# EAGLE design step_down_module (EAGLE 9.6.2)
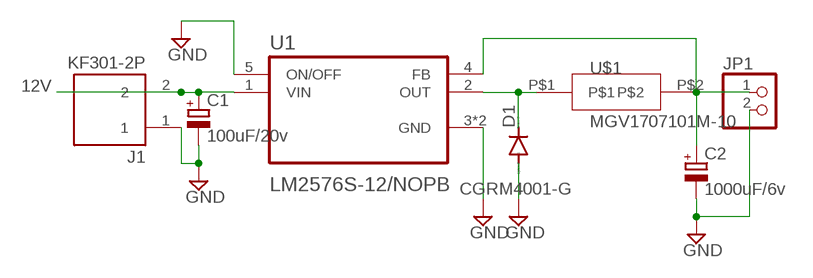
[diagram p0: schematic, sheet 1]

## Parts
C1  100uF/20v  CPOL-EUD/7343-31W  [D/7343-31W]
C2  1000uF/6v  CPOL-EUD/7343-31W  [D/7343-31W]
D1  CGRM4001-G  [SOD-123_MINI-SMA]
J1  KF301-2P  [HANDSON_KF301-2P]
JP1  PINHD-1X2  [1X02]
U1  LM2576S-12/NOPB  [VREG_TPS79625KTTR]
U$1  MGV1707101M-10  [MGV1707101M-10]

## Nets
12V: C1.+ J1.2 U1.1(VIN)
GND: C1.- C2.- D1.A J1.1 JP1.2 U1.3(GND) U1.5(ON/OFF) U1.6(GND)
N$2: D1.C U1.2(OUT) U$1.P$1
N$3: C2.+ JP1.1 U1.4(FB) U$1.P$2

## Library data of the parts
C1 C2 = rcl:CPOL-EU: POLARIZED CAPACITOR, European symbol; SPICEPREFIX: C
D1 = diode:CGRM400*-G: Molded plasitc,JEDEC SOD-123/Mini SMA Source: Comchip CGRM4001-G.pdf
J1 = KF301-2P:KF301-2P: 2 Pin Terminal Block 5mm Pitch Check availability <https://pricing.snapeda.com/parts/KF301-2P/Handson%20Technology/view-part?ref=eda>; AVAILABILITY: Not in stock; DESCRIPTION: 2 Pin Terminal Block 5mm Pitch; MF: Handson Technology; MP: KF301-2P; PACKAGE: None; PRICE: None
JP1 = pinhead:PINHD-1X2: PIN HEADER
U1 = LM2576S-12_NOPB:LM2576S-12/NOPB: Check availability <https://pricing.snapeda.com/parts/LM2576S-12/NOPB/Texas%20Instruments/view-part?ref=eda>; AVAILABILITY: In Stock; CHECK_PRICES: https://www.snapeda.com/parts/LM2576S-12/NOPB/Texas+Instruments/view-part/?ref=eda; DESCRIPTION: SIMPLE SWITCHER&reg; 40V, 3A Low Component Count Step-Down Regulator; MF: Texas Instruments; MP: LM2576S-12/NOPB; PACKAGE: TO-263-5 Texas Instruments; PRICE: None; PURCHASE-URL: https://www.snapeda.com/api/url_track_click_mouser/?unipart_id=470772&manufacturer=Texas Instruments&part_name=LM2576S-12/NOPB&search_term=None; SNAPEDA_LINK: https://www.snapeda.com/parts/LM2576S-12/NOPB/Texas+Instruments/view-part/?ref=snap
U$1 = MGV1707101M-10:MGV1707101M-10

## Board
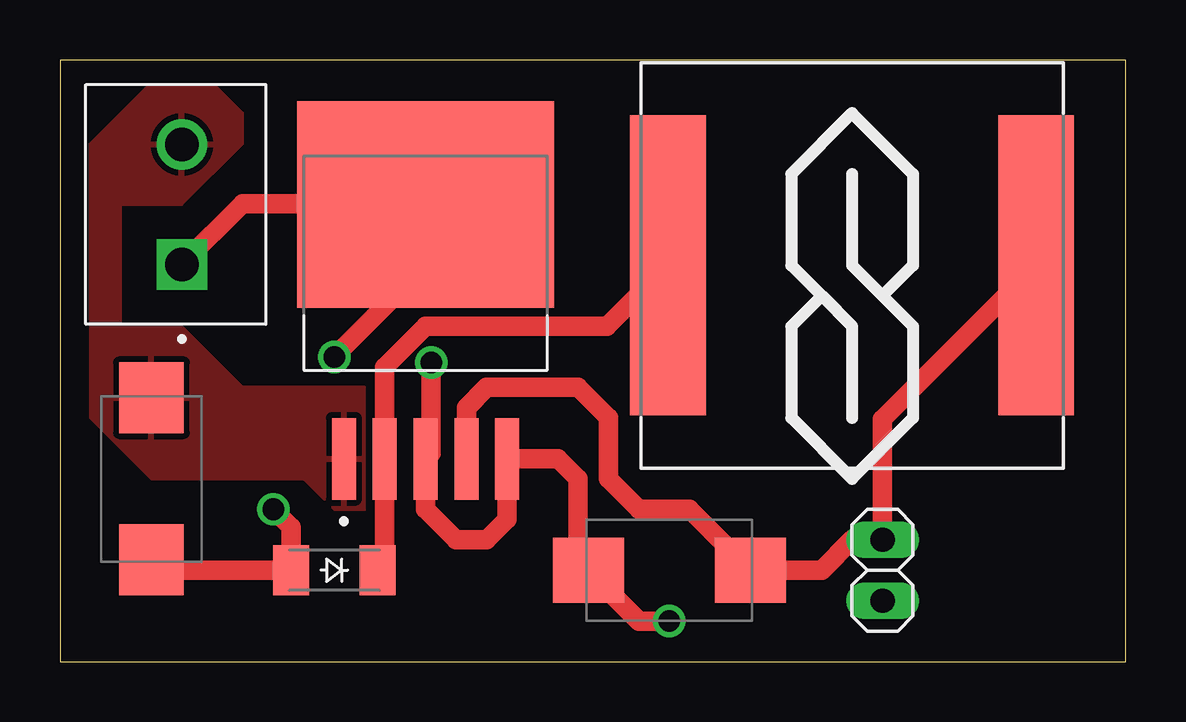
[diagram p1: board, top side]
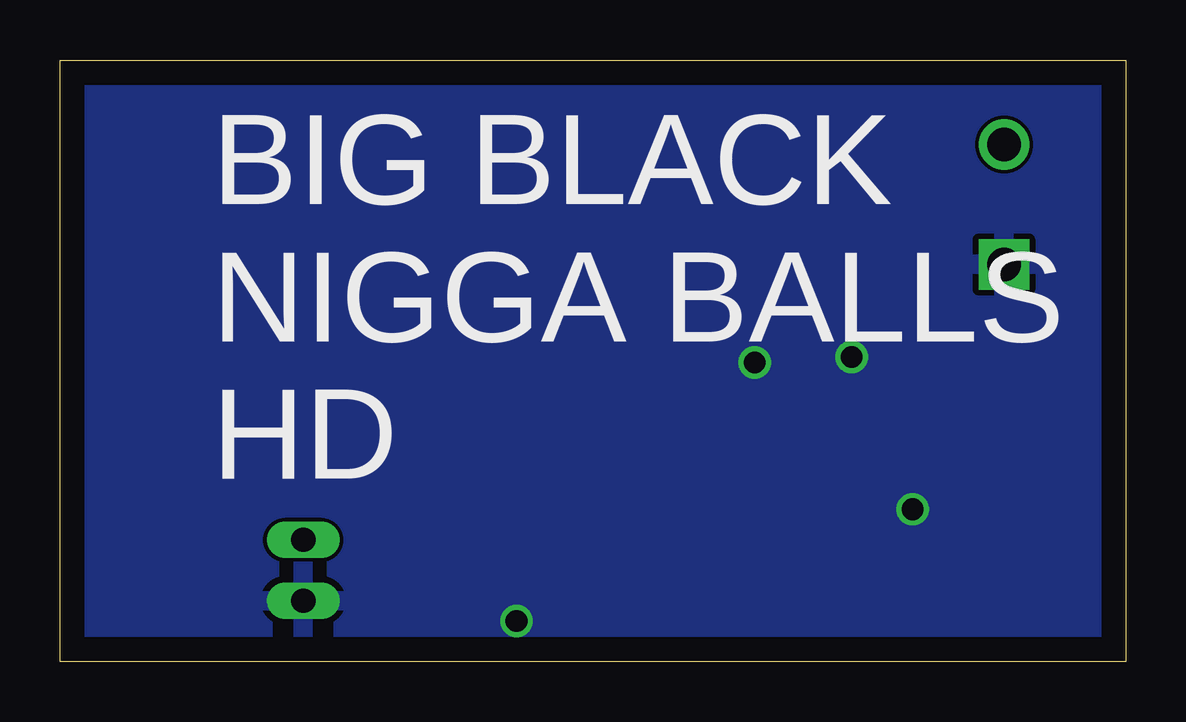
[diagram p2: board, bottom side, seen from below]

Size 44.43 x 25.07 mm. Coordinates in mm from the lower left corner, seen from the top.
Outline: 0,0 44.43,0 44.43,25.07 0,25.07 0,0
Copper layers (1*16): Top 0.035mm / dielectric 1.5mm / Bottom 0.035mm
Design rules "default": minimum track width 6mil, minimum drill 0.35mm, track to track 6mil, track to pad 6mil, pad to pad 6mil, via to via 6mil, smd to smd 6mil, copper to edge 40mil, drill to drill 6mil, minimum pad ring 10mil, minimum via ring 8mil, stop-mask expansion 4mil, vias tented up to drill 0mil, thermal gap 10mil

### Footprints (pad centres in the part's own frame; a part is rotated, then mirrored left to right if it is on the bottom)
D/7343-31W = smd 2.95 x 2.7: + 3.375,0; - -3.375,0
SOD-123_MINI-SMA = smd 1.5 x 2.1: A 1.8,0; C -1.8,0
HANDSON_KF301-2P = drill 1.4 square: 1 -2.5,0 | drill 1.4: 2 2.5,0
1X02 = drill 1.016 long: 1 -1.27,0; 2 1.27,0
VREG_TPS79625KTTR = smd 3.4 x 1: 1 -10.6,3.4; 2 -10.6,1.7; 3 -10.6,0; 4 -10.6,-1.7; 5 -10.6,-3.4 | smd 8.6 x 10.7: 6 0,0
MGV1707101M-10 = smd 3.15 x 12.5: P$1 -7.675,0; P$2 7.675,0

### Placement (x,y rotation side)
C1  3.81,7.62 90 top
C2  25.4,3.81 0 top
D1  11.43,3.81 180 top
J1  5.08,19.05 90 top
JP1  34.29,3.81 270 top
U1  15.24,19.05 90 top
U$1  33.02,16.51 0 top

### Tracks (layer width: path | path; a pad name or v marks a point on that pad's centre or on a via)
12V
  pour Top: 5.08,19.05 7.62,21.59 7.62,22.86 6.35,24.13 3.81,24.13 1.27,21.59 1.27,10.16 2.54,8.89 3.81,7.62 10.16,7.62 11.43,6.35 12.7,6.35 12.7,11.43 7.62,11.43 5.08,13.97 2.54,13.97 2.54,19.05
GND  (via drill 0.9)
  Top 0.813: C1.- 4.25,3.81 D1.A 9.63,5.61 v8.89,6.35 | J1.1 7.62,19.09 11.47,19.09 11.51,19.05 U1.6 15.24,16.51 v11.43,12.7 | v25.4,1.69 24.14,1.69 C2.- 21.59,4.24 21.59,7.62 20.76,8.45 U1.5 18.64,5.94 17.78,5.08 16.51,5.08 15.24,6.35 U1.3 15.48,8.69 v15.48,12.46
  pour Bottom: -3.81,5.08 -3.81,-1.27 46.99,-1.27 46.99,26.67 -2.54,26.67 -3.81,25.4
N$2
  Top 0.813: D1.C 13.54,4.12 U1.2 13.54,12.27 15.24,13.97 22.81,13.97 U$1.P$1
N$3
  Top 0.813: U1.4 16.94,10.59 17.78,11.43 21.59,11.43 22.86,10.16 22.86,7.62 24.13,6.35 26.23,6.35 C2.+ 31.75,3.81 33.02,5.08 JP1.1 34.29,10.1 U$1.P$2

### Text on the board
bPlace: BIG BLACK / NIGGA BALLS / HD